# EAGLE schematic tube-screamer (EAGLE 9.6.2)
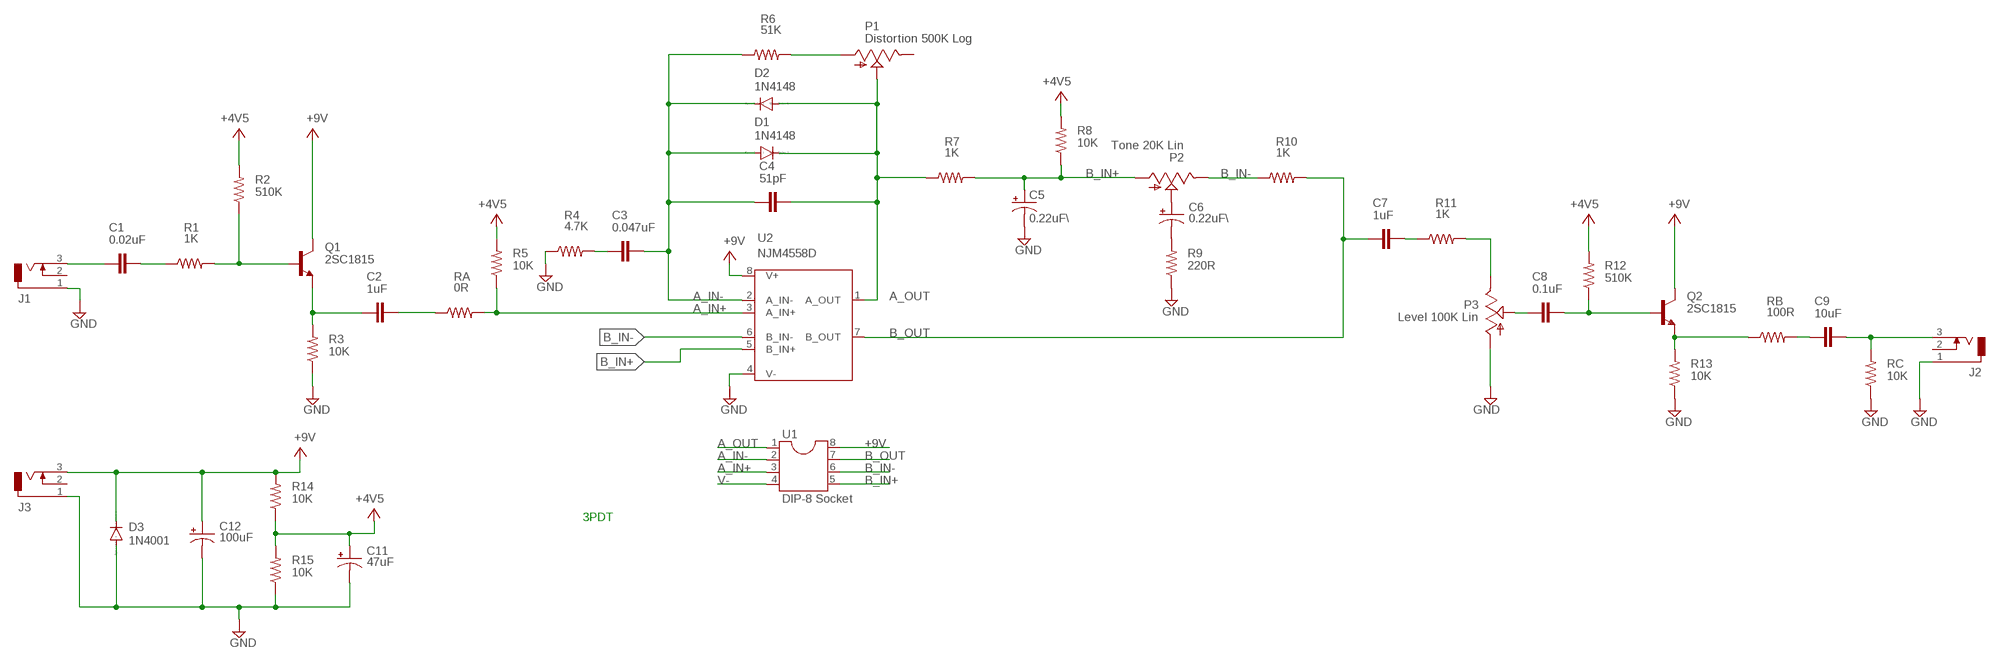
[diagram p0: schematic, sheet 1]

## Parts
C1  0.02uF  C-EU050-024X044  [C050-024X044]
C2  1uF  C-EU050-024X044  [C050-024X044]
C3  0.047uF  C-EU050-024X044  [C050-024X044]
C4  51pF  C-EU050-024X044  [C050-024X044]
C5  0.22uF\  CPOL-USTT2D5  [TT2D5]
C6  0.22uF\  CPOL-USTT2D5  [TT2D5]
C7  1uF  C-EU050-024X044  [C050-024X044]
C8  0.1uF  C-EU050-024X044  [C050-024X044]
C9  10uF  C-EU050-024X044  [C050-024X044]
C11  47uF  CPOL-USE5-10.5  [E5-10,5]
C12  100uF  CPOL-USE3.5-8  [E3,5-8]
D1  1N4148  1N4148DO35-7  [DO35-7]
D2  1N4148  1N4148DO35-7  [DO35-7]
D3  1N4001  1N4004  [DO41-10]
J1  JACK5.08MM  [POT-5.08MM]
J2  JACK5.08MM  [POT-5.08MM]
J3  JACK2.54MM  [1X03]
P1  Distortion 500K Log  POT  [POT-5.08MM]
P2  Tone 20K Lin  POT  [POT-5.08MM]
P3  Level 100K Lin  POT  [POT-5.08MM]
Q1  2SC1815  -NPN-TO92  [TO92]
Q2  2SC1815  -NPN-TO92  [TO92]
R1  1K  R-US_0309/12  [0309/12]
R2  510K  R-US_0309/12  [0309/12]
R3  10K  R-US_0309/12  [0309/12]
R4  4.7K  R-US_0309/12  [0309/12]
R5  10K  R-US_0309/12  [0309/12]
R6  51K  R-US_0309/12  [0309/12]
R7  1K  R-US_0309/12  [0309/12]
R8  10K  R-US_0309/12  [0309/12]
R9  220R  R-US_0309/12  [0309/12]
R10  1K  R-US_0309/12  [0309/12]
R11  1K  R-US_0309/12  [0309/12]
R12  510K  R-US_0309/12  [0309/12]
R13  10K  R-US_0309/12  [0309/12]
R14  10K  R-US_0309/12  [0309/12]
R15  10K  R-US_0309/12  [0309/12]
RA  0R  R-US_0309/12  [0309/12]
RB  100R  R-US_0309/12  [0309/12]
RC  10K  R-US_0309/12  [0309/12]
U1  DIP-8 Socket  DIL8S  [SOCKET-08]
U2  NJM4558D  [DIL08]

## Nets
+4.5V: R2.2 R5.2 R8.2 R12.2 U2.8(V+) ; supply symbol labelled +4V5, +9V
+4.5V\: C11.+ R14.1 R15.2 ; supply symbol labelled +4V5
+9V: C12.+ D3.C J3.3 Q1.3(C) Q2.3(C) R14.2 U1.8
A_IN+: R5.1 RA.2 U1.3 U2.3(A_IN+)
A_IN-: C3.2 C4.1 D1.A D2.C R6.1 U1.2 U2.2(A_IN-)
A_OUT: C4.2 D1.C D2.A P1.2 R7.1 U1.1 U2.1(A_OUT)
B_IN+: C5.+ P2.1 R7.2 R8.1 U1.5 U2.5(B_IN+)
B_IN-: P2.3 R10.1 U1.6 U2.6(B_IN-)
B_OUT: C7.1 R10.2 U1.7 U2.7(B_OUT)
GND: C5.- C11.- C12.- D3.A J1.1 J2.1 J3.1 P3.1 R3.1 R4.1 R9.1 R13.1 R15.1 RC.1 U2.4(V-)
N$1: C7.2 R11.1
N$2: P1.1 R6.2
N$3: C6.- R9.2
N$4: C6.+ P2.2
N$5: P3.3 R11.2
N$6: C8.1 P3.2
N$7: C8.2 Q2.2(B) R12.1
N$8: Q2.1(E) R13.2 RB.1
N$9: C9.1 RB.2
N$10: C1.2 R1.1
N$11: Q1.2(B) R1.2 R2.1
N$12: C9.2 J2.3 RC.2
N$13: C1.1 J1.3
N$17: C2.2 RA.1
N$19: C2.1 Q1.1(E) R3.2
N$20: C3.1 R4.2
V-: U1.4
Unconnected: J1.2 J2.2 J3.2 P1.3

## Notes on the sheet
- 3PDT

## Library data of the parts
C1-C4 C7-C9 = rcl:C-EU: CAPACITOR, European symbol; SPICEPREFIX: C
C5 C6 C11 C12 = rcl:CPOL-US: POLARIZED CAPACITOR, American symbol; SPICEPREFIX: C
D1 D2 = diode:1N4148: DIODE high speed (Philips)
D3 = diode:1N4004: DIODE general purpose rectifier, 1 A
J1-J3 = guitar-pedals:JACK
P1-P3 = guitar-pedals:POT
Q1 Q2 = transistor:*-NPN-: NPN Transistror BF959 corrected 2008.03.06
R1-R15 RA RB RC = rcl:R-US_: RESISTOR, American symbol; SPICEPREFIX: R
U1 = ic-package:DIL8: Dual In Line / Socket
U2 = guitar-pedals:NJM4558D: Dual In Line / Socket